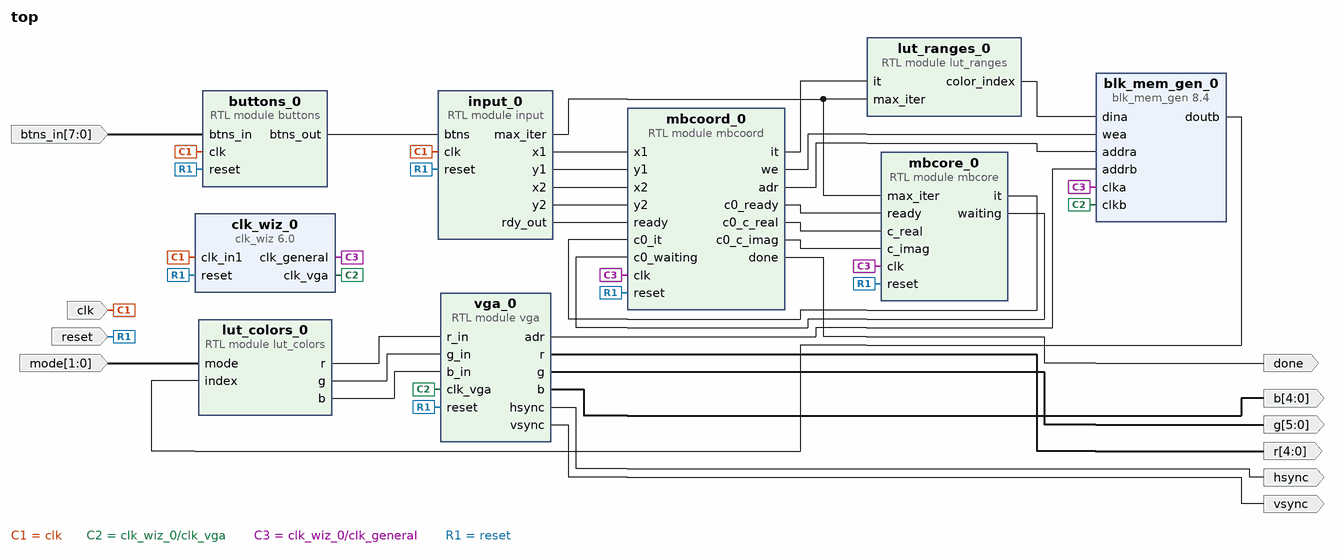
[diagram p0: block diagram of the top level]
# Vivado block design top, xc7z010clg400-1, Vivado 2018.3
create_bd_design top

create_bd_port -dir I -type clk clk
set_property -dict {CONFIG.FREQ_HZ 125000000} [get_bd_ports clk]
create_bd_port -dir O done
create_bd_port -dir O -from 4 -to 0 r
create_bd_port -dir O -from 5 -to 0 g
create_bd_port -dir O -from 4 -to 0 b
create_bd_port -dir O vsync
create_bd_port -dir O hsync
create_bd_port -dir I -type rst reset
set_property -dict {CONFIG.POLARITY ACTIVE_HIGH} [get_bd_ports reset]
create_bd_port -dir I -from 1 -to 0 mode
create_bd_port -dir I -from 7 -to 0 btns_in

create_bd_cell -type ip -vlnv xilinx.com:ip:blk_mem_gen:8.4 blk_mem_gen_0
set_property -dict [list \
  CONFIG.Algorithm Minimum_Area \
  CONFIG.Enable_32bit_Address false \
  CONFIG.Enable_A Always_Enabled \
  CONFIG.Enable_B Always_Enabled \
  CONFIG.Memory_Type Simple_Dual_Port_RAM \
  CONFIG.Operating_Mode_A NO_CHANGE \
  CONFIG.Port_B_Clock 100 \
  CONFIG.Port_B_Enable_Rate 100 \
  CONFIG.Read_Width_B 4 \
  CONFIG.Register_PortB_Output_of_Memory_Primitives false \
  CONFIG.Use_Byte_Write_Enable false \
  CONFIG.Write_Depth_A 480000 \
  CONFIG.Write_Width_A 4 \
  CONFIG.Write_Width_B 4 \
  CONFIG.use_bram_block Stand_Alone \
] [get_bd_cells blk_mem_gen_0]
create_bd_cell -type ip -vlnv xilinx.com:ip:clk_wiz:6.0 clk_wiz_0
set_property -dict [list \
  CONFIG.CLKIN1_JITTER_PS 80.0 \
  CONFIG.CLKIN2_JITTER_PS 174.98999999999998 \
  CONFIG.CLKOUT1_JITTER 150.675 \
  CONFIG.CLKOUT1_PHASE_ERROR 96.948 \
  CONFIG.CLKOUT1_REQUESTED_OUT_FREQ 40.000 \
  CONFIG.CLKOUT2_JITTER 143.688 \
  CONFIG.CLKOUT2_PHASE_ERROR 96.948 \
  CONFIG.CLKOUT2_REQUESTED_OUT_FREQ 50.000 \
  CONFIG.CLKOUT2_USED true \
  CONFIG.CLKOUT3_JITTER 124.615 \
  CONFIG.CLKOUT3_PHASE_ERROR 96.948 \
  CONFIG.CLKOUT3_REQUESTED_OUT_FREQ 100.000 \
  CONFIG.CLKOUT3_USED false \
  CONFIG.CLK_OUT1_PORT clk_vga \
  CONFIG.CLK_OUT2_PORT clk_general \
  CONFIG.CLK_OUT3_PORT clk_out3 \
  CONFIG.MMCM_CLKFBOUT_MULT_F 8.000 \
  CONFIG.MMCM_CLKIN1_PERIOD 8.000 \
  CONFIG.MMCM_CLKIN2_PERIOD 10.000 \
  CONFIG.MMCM_CLKOUT0_DIVIDE_F 25.000 \
  CONFIG.MMCM_CLKOUT1_DIVIDE 20 \
  CONFIG.MMCM_CLKOUT2_DIVIDE 1 \
  CONFIG.MMCM_DIVCLK_DIVIDE 1 \
  CONFIG.NUM_OUT_CLKS 2 \
  CONFIG.PRIM_IN_FREQ 125.000 \
  CONFIG.SECONDARY_SOURCE Single_ended_clock_capable_pin \
  CONFIG.USE_INCLK_SWITCHOVER false \
  CONFIG.USE_LOCKED false \
  CONFIG.USE_RESET true \
] [get_bd_cells clk_wiz_0]
create_bd_cell -type module -reference buttons buttons_0
create_bd_cell -type module -reference vga vga_0
create_bd_cell -type module -reference mbcoord mbcoord_0
create_bd_cell -type module -reference mbcore mbcore_0
create_bd_cell -type module -reference lut_ranges lut_ranges_0
create_bd_cell -type module -reference input input_0
create_bd_cell -type module -reference lut_colors lut_colors_0

# ---- connections ----

connect_bd_net [get_bd_ports clk] [get_bd_pins clk_wiz_0/clk_in1] [get_bd_pins buttons_0/clk] [get_bd_pins input_0/clk]
connect_bd_net [get_bd_pins clk_wiz_0/clk_vga] [get_bd_pins blk_mem_gen_0/clkb] [get_bd_pins vga_0/clk_vga]
connect_bd_net [get_bd_pins clk_wiz_0/clk_general] [get_bd_pins blk_mem_gen_0/clka] [get_bd_pins mbcoord_0/clk] [get_bd_pins mbcore_0/clk]
connect_bd_net [get_bd_pins mbcoord_0/we] [get_bd_pins blk_mem_gen_0/wea]
connect_bd_net [get_bd_pins mbcoord_0/done] [get_bd_ports done]
connect_bd_net [get_bd_pins mbcoord_0/adr] [get_bd_pins blk_mem_gen_0/addra]
connect_bd_net [get_bd_pins mbcoord_0/it] [get_bd_pins lut_ranges_0/it]
connect_bd_net [get_bd_pins lut_ranges_0/color_index] [get_bd_pins blk_mem_gen_0/dina]
connect_bd_net [get_bd_pins mbcoord_0/c0_ready] [get_bd_pins mbcore_0/ready]
connect_bd_net [get_bd_pins mbcoord_0/c0_c_real] [get_bd_pins mbcore_0/c_real]
connect_bd_net [get_bd_pins mbcoord_0/c0_c_imag] [get_bd_pins mbcore_0/c_imag]
connect_bd_net [get_bd_pins mbcore_0/it] [get_bd_pins mbcoord_0/c0_it]
connect_bd_net [get_bd_pins mbcore_0/waiting] [get_bd_pins mbcoord_0/c0_waiting]
connect_bd_net [get_bd_pins input_0/x1] [get_bd_pins mbcoord_0/x1]
connect_bd_net [get_bd_pins input_0/y1] [get_bd_pins mbcoord_0/y1]
connect_bd_net [get_bd_pins input_0/x2] [get_bd_pins mbcoord_0/x2]
connect_bd_net [get_bd_pins input_0/y2] [get_bd_pins mbcoord_0/y2]
connect_bd_net [get_bd_pins input_0/rdy_out] [get_bd_pins mbcoord_0/ready]
connect_bd_net [get_bd_pins lut_colors_0/r] [get_bd_pins vga_0/r_in]
connect_bd_net [get_bd_pins lut_colors_0/g] [get_bd_pins vga_0/g_in]
connect_bd_net [get_bd_pins lut_colors_0/b] [get_bd_pins vga_0/b_in]
connect_bd_net [get_bd_pins vga_0/r] [get_bd_ports r]
connect_bd_net [get_bd_pins vga_0/g] [get_bd_ports g]
connect_bd_net [get_bd_pins vga_0/b] [get_bd_ports b]
connect_bd_net [get_bd_pins vga_0/hsync] [get_bd_ports hsync]
connect_bd_net [get_bd_pins blk_mem_gen_0/doutb] [get_bd_pins lut_colors_0/index]
connect_bd_net [get_bd_ports reset] \
  [get_bd_pins clk_wiz_0/reset] [get_bd_pins buttons_0/reset] [get_bd_pins vga_0/reset] [get_bd_pins mbcoord_0/reset] \
  [get_bd_pins mbcore_0/reset] [get_bd_pins input_0/reset]
connect_bd_net [get_bd_ports mode] [get_bd_pins lut_colors_0/mode]
connect_bd_net [get_bd_pins vga_0/vsync] [get_bd_ports vsync]
connect_bd_net [get_bd_pins vga_0/adr] [get_bd_pins blk_mem_gen_0/addrb]
connect_bd_net [get_bd_ports btns_in] [get_bd_pins buttons_0/btns_in]
connect_bd_net [get_bd_pins buttons_0/btns_out] [get_bd_pins input_0/btns]
connect_bd_net [get_bd_pins input_0/max_iter] [get_bd_pins mbcore_0/max_iter] [get_bd_pins lut_ranges_0/max_iter]

validate_bd_design
save_bd_design
